# Altium schematic sheet PLCC-RP2350B-PSRAM.SchDoc
size C; SheetNumber: 1; SheetTotal: 1
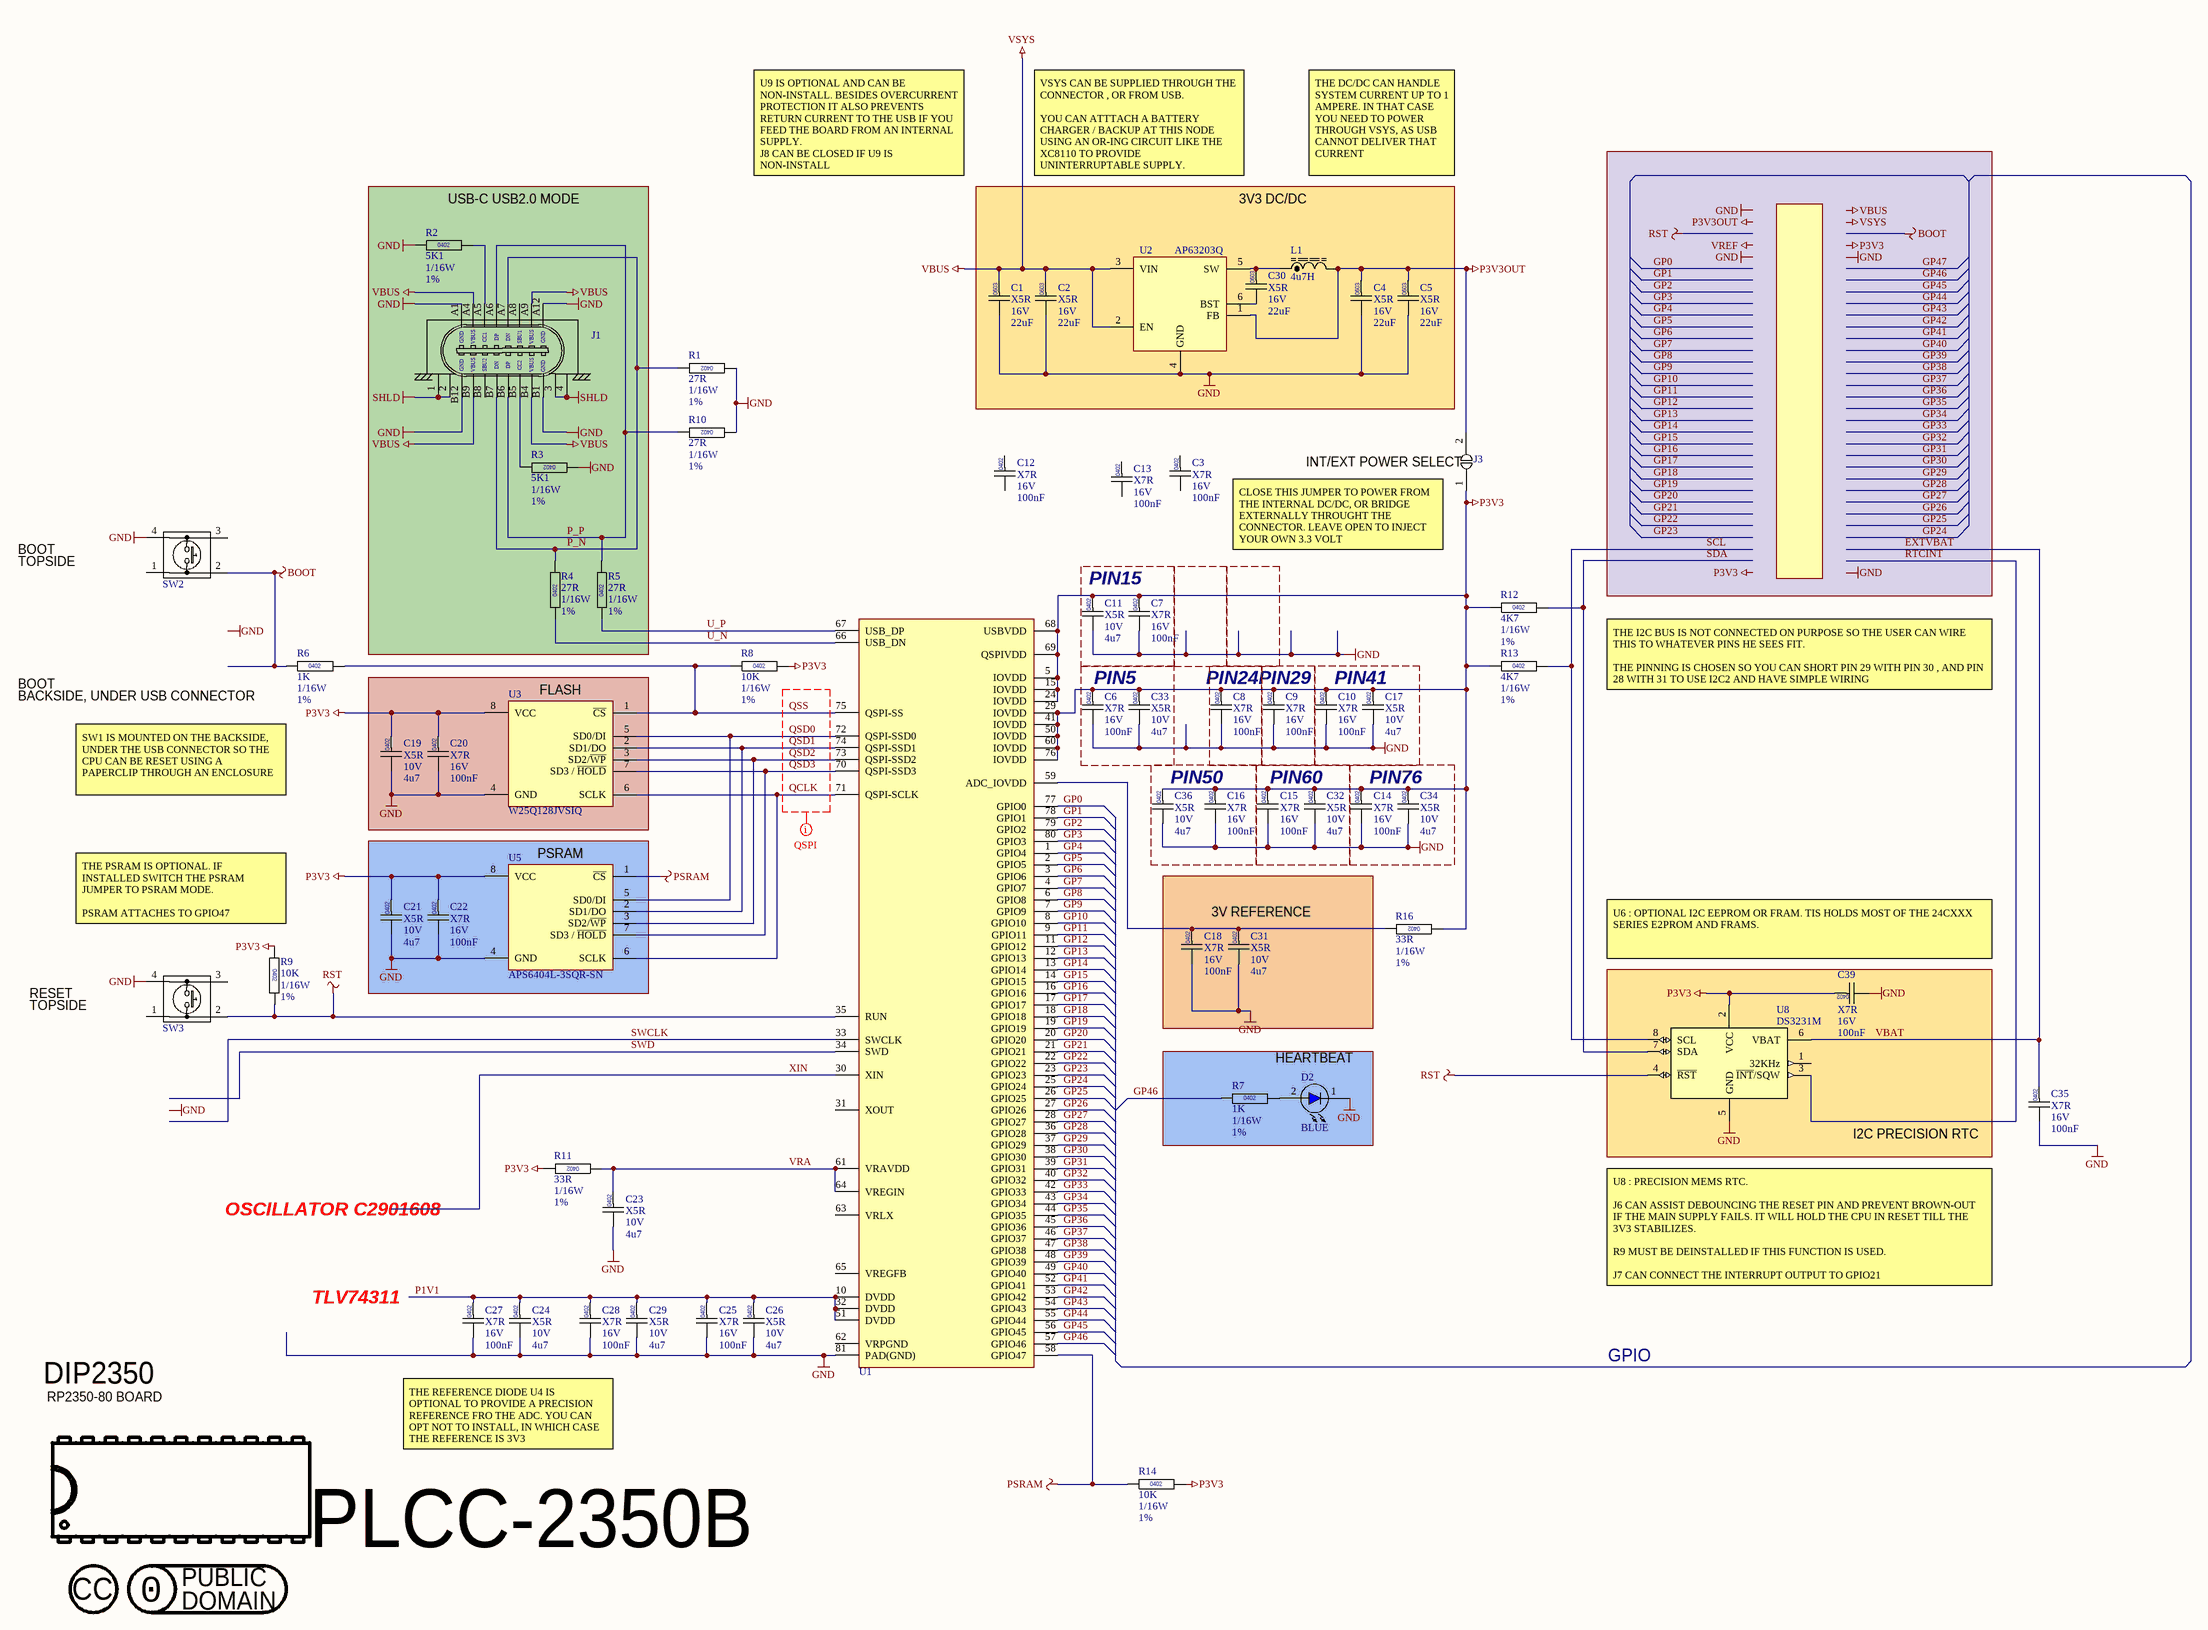
[diagram p0: PLCC-RP2350B-PSRAM.SchDoc]

## Parts
C1  Dielectric: X5R  Voltage: 16V  Capacitance: 22uF  [CAPC0603]  (hidden comment: CAP0603)
C2  Dielectric: X5R  Voltage: 16V  Capacitance: 22uF  [CAPC0603]  (hidden comment: CAP0603)
C3  Dielectric: X7R  Voltage: 16V  Capacitance: 100nF  [CAPC0402]  (hidden comment: CAP0402)
C4  Dielectric: X5R  Voltage: 16V  Capacitance: 22uF  [CAPC0603]  (hidden comment: CAP0603)
C5  Dielectric: X5R  Voltage: 16V  Capacitance: 22uF  [CAPC0603]  (hidden comment: CAP0603)
C6  Dielectric: X7R  Voltage: 16V  Capacitance: 100nF  [CAPC0402]  (hidden comment: CAP0402)
C7  Dielectric: X7R  Voltage: 16V  Capacitance: 100nF  [CAPC0402]  (hidden comment: CAP0402)
C8  Dielectric: X7R  Voltage: 16V  Capacitance: 100nF  [CAPC0402]  (hidden comment: CAP0402)
C9  Dielectric: X7R  Voltage: 16V  Capacitance: 100nF  [CAPC0402]  (hidden comment: CAP0402)
C10  Dielectric: X7R  Voltage: 16V  Capacitance: 100nF  [CAPC0402]  (hidden comment: CAP0402)
C11  Dielectric: X5R  Voltage: 10V  Capacitance: 4u7  [CAPC0402]  (hidden comment: CAP0402)
C12  Dielectric: X7R  Voltage: 16V  Capacitance: 100nF  [CAPC0402]  (hidden comment: CAP0402)
C13  Dielectric: X7R  Voltage: 16V  Capacitance: 100nF  [CAPC0402]  (hidden comment: CAP0402)
C14  Dielectric: X7R  Voltage: 16V  Capacitance: 100nF  [CAPC0402]  (hidden comment: CAP0402)
C15  Dielectric: X7R  Voltage: 16V  Capacitance: 100nF  [CAPC0402]  (hidden comment: CAP0402)
C16  Dielectric: X7R  Voltage: 16V  Capacitance: 100nF  [CAPC0402]  (hidden comment: CAP0402)
C17  Dielectric: X5R  Voltage: 10V  Capacitance: 4u7  [CAPC0402]  (hidden comment: CAP0402)
C18  Dielectric: X7R  Voltage: 16V  Capacitance: 100nF  [CAPC0402]  (hidden comment: CAP0402)
C19  Dielectric: X5R  Voltage: 10V  Capacitance: 4u7  [CAPC0402]  (hidden comment: CAP0402)
C20  Dielectric: X7R  Voltage: 16V  Capacitance: 100nF  [CAPC0402]  (hidden comment: CAP0402)
C21  Dielectric: X5R  Voltage: 10V  Capacitance: 4u7  [CAPC0402]  (hidden comment: CAP0402)
C22  Dielectric: X7R  Voltage: 16V  Capacitance: 100nF  [CAPC0402]  (hidden comment: CAP0402)
C23  Dielectric: X5R  Voltage: 10V  Capacitance: 4u7  [CAPC0402]  (hidden comment: CAP0402)
C24  Dielectric: X5R  Voltage: 10V  Capacitance: 4u7  [CAPC0402]  (hidden comment: CAP0402)
C25  Dielectric: X7R  Voltage: 16V  Capacitance: 100nF  [CAPC0402]  (hidden comment: CAP0402)
C26  Dielectric: X5R  Voltage: 10V  Capacitance: 4u7  [CAPC0402]  (hidden comment: CAP0402)
C27  Dielectric: X7R  Voltage: 16V  Capacitance: 100nF  [CAPC0402]  (hidden comment: CAP0402)
C28  Dielectric: X7R  Voltage: 16V  Capacitance: 100nF  [CAPC0402]  (hidden comment: CAP0402)
C29  Dielectric: X5R  Voltage: 10V  Capacitance: 4u7  [CAPC0402]  (hidden comment: CAP0402)
C30  Dielectric: X5R  Voltage: 16V  Capacitance: 22uF  [CAPC0603]  (hidden comment: CAP0603)
C31  Dielectric: X5R  Voltage: 10V  Capacitance: 4u7  [CAPC0402]  (hidden comment: CAP0402)
C32  Dielectric: X5R  Voltage: 10V  Capacitance: 4u7  [CAPC0402]  (hidden comment: CAP0402)
C33  Dielectric: X5R  Voltage: 10V  Capacitance: 4u7  [CAPC0402]  (hidden comment: CAP0402)
C34  Dielectric: X5R  Voltage: 10V  Capacitance: 4u7  [CAPC0402]  (hidden comment: CAP0402)
C35  Dielectric: X7R  Voltage: 16V  Capacitance: 100nF  [CAPC0402]  (hidden comment: CAP0402)
C36  Dielectric: X5R  Voltage: 10V  Capacitance: 4u7  [CAPC0402]  (hidden comment: CAP0402)
C39  Dielectric: X7R  Voltage: 16V  Capacitance: 100nF  [CAPC0402]  (hidden comment: CAP0402)
D2  BLUE  [LED-0603-BLUE]
J1  CONN-USBC-USB2-HOR  [CONN-GCT-USB4085]  (value not drawn)
J3  SOLDERPAD-2  [SOLDERPAD-2]  (value not drawn)  (no BOM)
L1  value 4u7H  [IND-ABRACON-ASPI-3012S-3R9N-T]  (hidden comment: 4.7uH)
LOGO1  LOGO-LICENSE-CC0-PUBLIC  [LOGO-LICENSE-CC0-PUBLIC]  (value not drawn)  (no BOM)
LOGO2  LOGO-LICENSE-CC  [LOGO-LICENSE-CC]  (value not drawn)  (no BOM)
R1  value 27R  Power: 1/16W  Tolerance: 1%  [RESC0402]  (hidden comment: RESC0402)
R2  value 5K1  Power: 1/16W  Tolerance: 1%  [RESC0402]  (hidden comment: RESC0402)
R3  value 5K1  Power: 1/16W  Tolerance: 1%  [RESC0402]  (hidden comment: RESC0402)
R4  value 27R  Power: 1/16W  Tolerance: 1%  [RESC0402]  (hidden comment: RESC0402)
R5  value 27R  Power: 1/16W  Tolerance: 1%  [RESC0402]  (hidden comment: RESC0402)
R6  value 1K  Power: 1/16W  Tolerance: 1%  [RESC0402]  (hidden comment: RESC0402)
R7  value 1K  Power: 1/16W  Tolerance: 1%  [RESC0402]  (hidden comment: RESC0402)
R8  value 10K  Power: 1/16W  Tolerance: 1%  [RESC0402]  (hidden comment: RESC0402)
R9  value 10K  Power: 1/16W  Tolerance: 1%  [RESC0402]  (hidden comment: RESC0402)
R10  value 27R  Power: 1/16W  Tolerance: 1%  [RESC0402]  (hidden comment: RESC0402)
R11  value 33R  Power: 1/16W  Tolerance: 1%  [RESC0402]  (hidden comment: RESC0402)
R12  value 4K7  Power: 1/16W  Tolerance: 1%  [RESC0402]  (hidden comment: RESC0402)
R13  value 4K7  Power: 1/16W  Tolerance: 1%  [RESC0402]  (hidden comment: RESC0402)
R14  value 10K  Power: 1/16W  Tolerance: 1%  [RESC0402]  (hidden comment: RESC0402)
R16  value 33R  Power: 1/16W  Tolerance: 1%  [RESC0402]  (hidden comment: RESC0402)
SW2  SWITCH-PANASONIC-EVP-AA202K  [SWITCH-PANASONIC-EVP-AA202K]  (value not drawn)
SW3  SWITCH-PANASONIC-EVP-AA202K  [SWITCH-PANASONIC-EVP-AA202K]  (value not drawn)
U1  IC-RP2350-DIP64  [QFN40P1000X1000X90_HS-81N]  (value not drawn)
U2  AP63203Q  [SOT23-6]
U3  W25Q128JVSIQ  [SO127P790-8N]
U5  APS6404L-3SQR-SN  [SO127P600-8N]
U8  DS3231M  [SO127P600-8N]

## Blocks framed on the sheet
USB-C USB2.0 MODE: J1 R2-R5
3V3 DC/DC: C1 C2 C4 C5 C30 L1 U2
PIN15: C7 C11
FLASH: C19 C20 U3
PIN5: C6 C33
PIN24: C8
PIN29: C9
PIN41: C10 C17
PIN50: C16 C36
PIN60: C15 C32
PIN76: C14 C34
PSRAM: C21 C22 U5
3V REFERENCE: C18 C31
I2C PRECISION RTC: C39 U8
HEARTBEAT: D2 R7

## Nets
BOOT: R6.1 SW2.2
GND: C1.2 C2.2 C4.2 C5.2 C6.2 C7.2 C8.2 C9.2 C10.2 C11.2 C14.2 C15.2 C16.2 C17.2 C18.2 C19.2 C20.2 C21.2 C22.2 C23.2 C24.2 C25.2 C26.2 C27.2 C28.2 C29.2 C31.2 C32.2 C33.2 C34.2 C35.2 C36.2 C39.2 D2.1(A) J1.A1 J1.A12 J1.B1 J1.B12 R1.2 R2.2 R3.2 R10.2 SW2.4 SW3.4 U1.81(PAD(GND)) U2.4(GND) U3.4(GND) U5.4(GND) U8.5(GND)
P3V3: C6.1 C7.1 C8.1 C9.1 C10.1 C11.1 C14.1 C15.1 C16.1 C17.1 C19.1 C20.1 C21.1 C22.1 C32.1 C33.1 C34.1 C36.1 C39.1 J3.1 R8.2 R9.2 R11.1 R12.1 R13.1 R14.2 R16.2 U1.5(IOVDD) U1.15(IOVDD) U1.24(IOVDD) U1.29(IOVDD) U1.41(IOVDD) U1.50(IOVDD) U1.60(IOVDD) U1.68(USBVDD) U1.69(QSPIVDD) U1.76(IOVDD) U3.8(VCC) U5.8(VCC) U8.2(VCC)
P3V3OUT: C4.1 C5.1 J3.2 L1.2 U2.1(FB)
PSRAM: R14.1 U1.58(GPIO47) U5.1(~{CS})
RST: R9.1 SW3.2 U1.35(RUN) U8.4(~{RST})
SHLD: J1.1 J1.2 J1.3 J1.4
VBUS: C1.1 C2.1 J1.A4 J1.A9 J1.B4 J1.B9 U2.2(EN) U2.3(VIN)  [also labelled VSYS]
EXTVBAT: C35.1 U8.6(VBAT)  [also labelled VBAT]
GP0: U1.77(GPIO0)
GP1: U1.78(GPIO1)
GP2: U1.79(GPIO2)
GP3: U1.80(GPIO3)
GP4: U1.1(GPIO4)
GP5: U1.2(GPIO5)
GP6: U1.3(GPIO6)
GP7: U1.4(GPIO7)
GP8: U1.6(GPIO8)
GP9: U1.7(GPIO9)
GP10: U1.8(GPIO10)
GP11: U1.9(GPIO11)
GP12: U1.11(GPIO12)
GP13: U1.12(GPIO13)
GP14: U1.13(GPIO14)
GP15: U1.14(GPIO15)
GP16: U1.16(GPIO16)
GP17: U1.17(GPIO17)
GP18: U1.18(GPIO18)
GP19: U1.19(GPIO19)
GP20: U1.20(GPIO20)
GP21: U1.21(GPIO21)
GP22: U1.22(GPIO22)
GP23: U1.23(GPIO23)
GP24: U1.25(GPIO24)
GP25: U1.26(GPIO25)
GP26: U1.27(GPIO26)
GP27: U1.28(GPIO27)
GP28: U1.36(GPIO28)
GP29: U1.37(GPIO29)
GP30: U1.38(GPIO30)
GP31: U1.39(GPIO31)
GP32: U1.40(GPIO32)
GP33: U1.42(GPIO33)
GP34: U1.43(GPIO34)
GP35: U1.44(GPIO35)
GP36: U1.45(GPIO36)
GP37: U1.46(GPIO37)
GP38: U1.47(GPIO38)
GP39: U1.48(GPIO39)
GP40: U1.49(GPIO40)
GP41: U1.52(GPIO41)
GP42: U1.53(GPIO42)
GP43: U1.54(GPIO43)
GP44: U1.55(GPIO44)
GP45: U1.56(GPIO45)
GP46: R7.1 U1.57(GPIO46)
P1V1: C24.1 C25.1 C26.1 C27.1 C28.1 C29.1 U1.10(DVDD) U1.32(DVDD) U1.51(DVDD)
P_N: J1.A7 J1.B7 R1.1 R4.1
P_P: J1.A6 J1.B6 R5.1 R10.1
QCLK: U1.71(QSPI-SCLK) U3.6(SCLK) U5.6(SCLK)
QSD0: U1.72(QSPI-SSD0) U3.5(SD0/DI) U5.5(SD0/DI)
QSD1: U1.74(QSPI-SSD1) U3.2(SD1/DO) U5.2(SD1/DO)
QSD2: U1.73(QSPI-SSD2) U3.3(SD2/~{WP}) U5.3(SD2/~{WP})
QSD3: U1.70(QSPI-SSD3) U3.7(SD3_/_~{HOLD}) U5.7(SD3_/_~{HOLD})
QSS: R6.2 R8.1 U1.75(QSPI-SS) U3.1(~{CS})
RTCINT: U8.3(~{INT}/SQW)
SCL: R13.2 U8.8(SCL)
SDA: R12.2 U8.7(SDA)
SWCLK: U1.33(SWCLK)
SWD: U1.34(SWD)
U_N: R4.2 U1.66(USB_DN)
U_P: R5.2 U1.67(USB_DP)
VRA: C23.1 R11.2 U1.61(VRAVDD) U1.64(VREGIN)
XIN: U1.30(XIN)
NetC18_1: C18.1 C31.1 R16.1 U1.59(ADC_IOVDD)
NetC30_1: C30.1 L1.1 U2.5(SW)
NetC30_2: C30.2 U2.6(BST)
NetD2_2: D2.2(K) R7.2
NetJ1_A5: J1.A5 R2.1
NetJ1_B5: J1.B5 R3.1

Not connected (* = marked no-connect by the designer): C3 1 2; C12 1 2; C13 1 2; J1 A8 B8; SW2 1 3; SW3 1 3; U1 31(XOUT) 62(VRPGND) 63(VRLX) 65(VREGFB); U8 1(32KHz)

## Layout directives
net class QSPI; rule Matched Net Lengths [Delay Tolerance = 50ps]; rule Length Constraint [Min Delay = 0ps    Max Delay = 500ps]: QCLK, QSD0, QSD1, QSD2, QSD3, QSS

## Notes on the sheet
- U9 IS OPTIONAL AND CAN BE NON-INSTALL. BESIDES OVERCURRENT PROTECTION IT ALSO PREVENTS RETURN CURRENT TO THE USB IF YOU FEED THE BOARD FROM AN INTERNAL SUPPLY.
  J8 CAN BE CLOSED IF U9 IS NON-INSTALL
- VSYS CAN BE SUPPLIED THROUGH THE CONNECTOR , OR FROM USB.
  YOU CAN ATTTACH A BATTERY CHARGER / BACKUP AT THIS NODE USING AN OR-ING CIRCUIT LIKE THE XC8110 TO PROVIDE UNINTERRUPTABLE SUPPLY.
- THE DC/DC CAN HANDLE SYSTEM CURRENT UP TO 1 AMPERE. IN THAT CASE YOU NEED TO POWER THROUGH VSYS, AS USB CANNOT DELIVER THAT CURRENT
- (near J3) INT/EXT POWER SELECT
- BOOT
- TOPSIDE
- (near J3) CLOSE THIS JUMPER TO POWER FROM THE INTERNAL DC/DC, OR BRIDGE EXTERNALLY THROUGHT THE CONNECTOR. LEAVE OPEN TO INJECT YOUR OWN 3.3 VOLT
- BACKSIDE, UNDER USB CONNECTOR
- THE I2C BUS IS NOT CONNECTED ON PURPOSE SO THE USER CAN WIRE THIS TO WHATEVER PINS HE SEES FIT.
  THE PINNING IS CHOSEN SO YOU CAN SHORT PIN 29 WITH PIN 30 , AND PIN 28 WITH 31 TO USE I2C2 AND HAVE SIMPLE WIRING
- SW1 IS MOUNTED ON THE BACKSIDE, UNDER THE USB CONNECTOR SO THE CPU CAN BE RESET USING A PAPERCLIP THROUGH AN ENCLOSURE
- (near R9) THE PSRAM IS OPTIONAL. IF INSTALLED SWITCH THE PSRAM JUMPER TO PSRAM MODE.
  PSRAM ATTACHES TO GPIO47
- (near C39) U6 : OPTIONAL I2C EEPROM OR FRAM. TIS HOLDS MOST OF THE 24CXXX SERIES E2PROM AND FRAMS.
- RESET
- OSCILLATOR C2901608
- TLV74311
- U8 : PRECISION MEMS RTC.
  J6 CAN ASSIST DEBOUNCING THE RESET PIN AND PREVENT BROWN-OUT IF THE MAIN SUPPLY FAILS. IT WILL HOLD THE CPU IN RESET TILL THE 3V3 STABILIZES.
  R9 MUST BE DEINSTALLED IF THIS FUNCTION IS USED.
  J7 CAN CONNECT THE INTERRUPT OUTPUT TO GPIO21
- DIP2350
- GPIO
- RP2350-80 BOARD
- THE REFERENCE DIODE U4 IS OPTIONAL TO PROVIDE A PRECISION REFERENCE FRO THE ADC. YOU CAN OPT NOT TO INSTALL, IN WHICH CASE THE REFERENCE IS 3V3
- PLCC-2350B
- Labels drawn without touching a wire or pin: GND, P3V3, P3V3OUT, VBUS, VREF, VSYS
- (in symbol CAPC-0402-4u7-10V-X5R) 0402
- (in symbol CONN-USBC-USB2-HOR) GND; VBUS; CC1; DP; DN; SBU1; SBU2; CC2
- (in symbol LOGO-LICENSE-CC) CC
- (in symbol LOGO-LICENSE-CC0-PUBLIC) PUBLIC; 0; DOMAIN
- (in symbol RESC-0402-1K-1%-1/10W) 0402
- (in symbol RESC-0402-4K7-1%-1/10W) 0402
- (in symbol RESC-0402-5K1-1%-1/10W) 0402
- (in symbol RESC-0402-10K-1%-1/10W) 0402
- (in symbol RESC-0402-27R-1%-1/10W) 0402
- (in symbol RESC-0402-33R-1%-1/10W) 0402

## Library data of the parts
C1 C2 C4 C5 C30 = CAPC-0603-22uF-16V-X5R: CAPACITOR,CERAMIC,22uF,16V,X5R,0603; Package / Case: 0603; Location: *; Supplier 1: Digikey; Supplier Part Number 1: 1276-7076-1-ND; LCSC: C2762594
C3 C6-C10 C12-C16 C18 C20 C22 C25 C27 C28 C35 C39 = CAPC-0402-100nF-16V-X7R: CAPACITOR,CERAMIC,100nF,16V,X7R,0402; Package / Case: 0402; Location: *; Supplier 1: Digikey; Supplier Part Number 1: 1292-1630-1-ND; LCSC: C60474
C11 C17 C19 C21 C23 C24 C26 C29 C31-C34 C36 = CAPC-0402-4u7-10V-X5R: CAPACITOR,CERAMIC,4u7,10V,X5R,0402; Package / Case: 0603; Location: *; Supplier 1: Digikey; Supplier Part Number 1: 1276-1482-1-ND; LCSC: C1705
D2 = LED-WURTH-150060BS75000: LED,BLUE,0603; LCSC: C965807; Supplier 1: Digikey; Supplier Part Number 1: 732-4966-1-ND
J1 = CONN-USBC-USB2-HOR: CONN,USB-C,16P,RA,TH,8.94X9.17; Supplier 1: Digikey; Supplier Part Number 1: 2073-USB4085-GF-ACT-ND; LCSC: C36936564
L1 = IND-TAIYO-NRH3012T4R7MN: IND,4.7uH,1.06A,3X3, NRH3012T4R7MN; LCSC: C5159666; Supplier 1: Digikey; Supplier Part Number 1: 587-2591-1-ND
R1 R4 R5 R10 = RESC-0402-27R-1%-1/10W: RESISTOR,27R,1%,63mW,0402 (1005); Location: *; Supplier 1: Future Electronics; Supplier Part Number 1: 2577120; LCSC: C138021
R2 R3 = RESC-0402-5K1-1%-1/10W: RESISTOR,5K1,1%,63mW,0402 (1005); Location: *; LCSC: C105872; Supplier 1: Future Electronics; Supplier Part Number 1: 6053649
R6 R7 = RESC-0402-1K-1%-1/10W: RESISTOR,1K,1%,63mW,0402 (1005); Location: *; LCSC: C106235; Supplier 1: Future Electronics; Supplier Part Number 1: 7825607
R8 R9 R14 = RESC-0402-10K-1%-1/10W: RESISTOR,10K,1%,63mW,0402 (1005); Location: *; LCSC: C60490; Supplier 1: Future Electronics; Supplier Part Number 1: 3388022
R11 R16 = RESC-0402-33R-1%-1/10W: RESISTOR,33R,1%,63mW,0402 (1005); Location: *; LCSC: C138002; Supplier 1: Future Electronics; Supplier Part Number 1: 8177883
R12 R13 = RESC-0402-4K7-1%-1/10W: RESISTOR,4K7,1%,63mW,0402 (1005); Location: *; LCSC: C105871; Supplier 1: Future Electronics; Supplier Part Number 1: 3795218
SW2 SW3 = SWITCH-PANASONIC-EVP-AA202K: SW,SMD,TACT,4PIN,2.9X3.5,4PIN; Supplier 1: Mouser; Supplier Part Number 1: 667-EVP-AA202K; LCSC: C483888
U1 = IC-RP2350-DIP64: IC,CPU,RP2350B,QFN80; LCSC: C42415655
U2 = IC-DIODES-AP63203Q: IC,PMIC,STEP-DOWN, 2A 3.3V; Supplier 1: Digikey; Supplier Part Number 1: 31-AP63203QWU-7CT-ND; LCSC: C780769
U3 = IC-WINBOND-W25Q128JVSIQ: IC,FLASH,QSPI,16Mx8; Supplier 1: Digikey; Supplier Part Number 1: W25Q128JVSIQCT-ND; LCSC: C97521
U5 = IC-APMEMORY-APS6404L-3SQR-SN: IC,PSRAM,QSPI,8Mx8,SO8; LCSC: C5333729; Supplier 1: Mouser; Supplier Part Number 1: 878-APS6404L-3SQR-SN
U8 = IC-ANALOG-DS3231M: IC,RTC,I2C,DS3231M; Supplier 1: Mouser; Supplier Part Number 1: 700-DS3231MZ+TRL; LCSC: C107410